# Altium schematic sheet 3.3v_BUCK.SchDoc: Shipwars Buck Schematic
size 431 x 279 mm; CheckedBy: SP, PS; Author: SP, PS; CompanyName: UPenn; DrawnBy: SP, PS; Engineer: SP, PS; Organization: UPenn; Address1: 200 S 33rd Street; Address2: Detkin Lab; Address3: Philadelphia; Address4: PA 19104; Revision: .1.0.0; SheetNumber: 7; SheetTotal: 10; Project: Shipwars
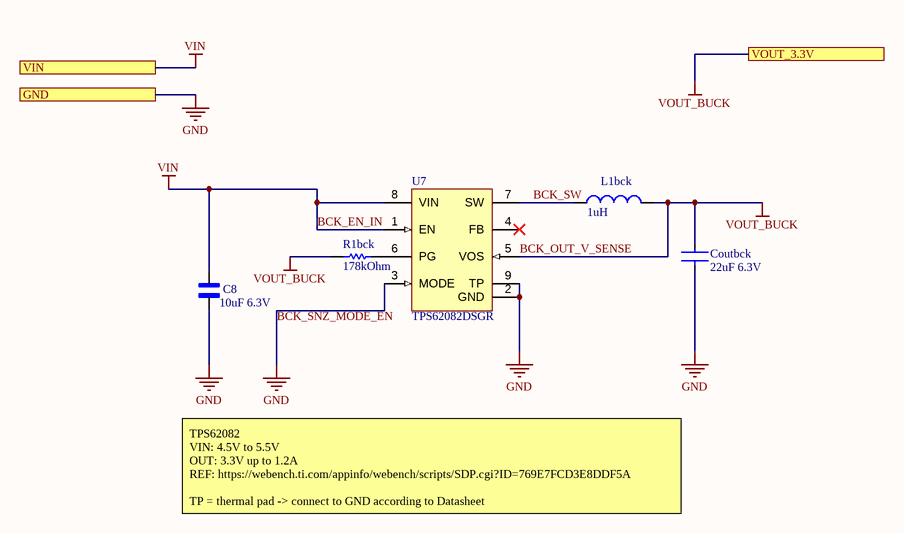
[diagram p0: 3.3v_BUCK.SchDoc]

## Parts
C8  10uF 6.3V  [GRJ155R60J106ME11D]
Coutbck  22uF 6.3V  [FP-GRM188-0_2-IPC_B]
L1bck  1uH  [WE-HCI-7040]
R1bck  178kOhm  [RESC1608X55X25NL10T15]
U7  TPS62082DSGR  [DSG8-1600X900TP]

## Ports
GND, VIN, VOUT_3.3V

## Nets
BCK_EN_IN: C8.2 U7.1(EN) U7.8(VIN) ; port VIN  [also labelled VIN]
BCK_OUT_V_SENSE: Coutbck.2 L1bck.2 R1bck.1 U7.5(VOS) ; port VOUT_3.3V  [also labelled VOUT_BUCK]
BCK_SNZ_MODE_EN: C8.1 Coutbck.1 U7.2(GND) U7.3(MODE) U7.9(TP) ; port GND  [also labelled GND]
BCK_SW: L1bck.1 U7.7(SW)
NetR1bck_2: R1bck.2 U7.6(PG)

Not connected (* = marked no-connect by the designer): U7 4(FB)*

## Notes on the sheet
- TPS62082
  VIN: 4.5V to 5.5V
  OUT: 3.3V up to 1.2A
  REF: https://webench.ti.com/appinfo/webench/scripts/SDP.cgi?ID=769E7FCD3E8DDF5A
  TP = thermal pad -> connect to GND according to Datasheet
- DWG. NO.
- REV.
- SHT.
- THIS DOCUMENT AND THE DATA DISCLOSED HEREIN OR HEREWITH IS THE PROPERTY OF ALTIUM LIMITED AND MAY BE FREELY DISTRIBUTED IN WHOLE. NO RIGHTS ARE RESERVED OR EXPRESS OR IMPLIED WARANTEE GIVEN.
- REVISION
- DESCRIPTION
- DATE
- APPROVED
- ENG:
- APPROVALS
- PROJECT
- DSN:
- CHK:
- REFERENCE DOCUMENTS
- PROJECT REVISION:
- TITLE
- DOCUMENT REVISION:
- DESIGN ITEM:
- BOM:
- FAB DWG:
- PCB DWG:
- ASSY DWG:
- SCALE:
- SIZE
- B
- CAGE CODE
- FILE NAME
- DWG NO.
- SHEET
- OF
- REV

## Library data of the parts
C8 = GRJ155R60J106ME11D: Capacitor Ceramic Mlcc 0402 10UF 6.3V SMD; Manufacturer: Murata; Tolerance: 20%; Supplier 1: Digi-Key; Manufacturer Part Number: GRJ155R60J106ME11D; RoHS: Yes; Category: Ceramic Capacitors; Stock 1: 1880133; Pricing 1: 10000=0.03490, 20000=0.03307 (USD); Mount: Surface Mount; Case/Package: 0402; Case Code (Metric): 1005; Case Code (Imperial): 0402; Min Operating Temperature: -55°C; Max Operating Temperature: 85°C; Packaging: Cut Tape; Capacitance: 10uF; Voltage Rating: 6.3V; Features: Soft Termination; Length: 0.039inch; Width: 0.02inch; Thickness: 0.028inch; RoHS Compliant: Yes; ComponentLink1URL: http://psearch.en.murata.com/capacitor/product/GRJ155R60J106ME11%23.pdf?src-supplier=Digi-Key; ComponentLink1Description: http://psearch.en.murata.com/capacitor/product/GRJ155R60J106ME11%23.pdf?src-supplier=Digi-Key
Coutbck = CMP-2006-02797-2: Chip Multilayer Ceramic Capacitors for General Purpose, 0603, 22uF, X5R, 15%, 20%, 6.3V GRM188R60J226MEA0D; Package Quantity: 4000; Case/Package: 0603; Dielectric: X5R; Packaging: Tape and Reel; Mount: Surface Mount; Voltage Rating: 6.3V; Lead Free: Lead Free; Voltage Rating (DC): 6.3V; Depth: 0.8mm; Case Code (Metric): 1608; Case Code (Imperial): 0603; Weight: 0.000222oz; REACH SVHC: No SVHC; Max Operating Temperature: 85°C; Tolerance: 20%; Min Operating Temperature: -55°C; Thickness: 0.039inch; Capacitance: 22uF; Length: 1.6mm; Height: 0.8mm; Termination: SMD/SMT; Width: 0.8mm
L1bck = CMP-0226-00067-1: SMD Flat Wire High Current Inductor WE-HCI, L=1.00 µH 744311100; Inductance: 1.00 ÂµH; PackageReference: WE-HCI-7040; ComponentLink2Description: Datasheet; ComponentLink1Description: Manufacturer Link; PackageVersion: 2008; ComponentLink2URL: http://www.we-online.de/katalog/media/pdf/744311100.pdf; DatasheetVersion: ver 1, Feb-2008; PackageDescription: SMD Inductor, 2-Leads, Body 7.0 x 6.9 mm; ComponentLink1URL: http://www.we-online.com
R1bck = CMP-1012-00762-2: RC0603FR-07178KL; Manufacturer: Yageo; Part Number: RC0603FR-07178KL
U7 = CMP-0323-00344-1: Buck Step Down Regulator with 2.3 to 6 V Input and 3.3 V Output, -40 to 85 degC, 8-Pin WSON (DSG), Green (RoHS & no Sb/Br); Manufacturer: Texas Instruments; Vout(Min)(V): 3.3; Switch Current Limit(Typ)(A): 2.4; SubFamily: Step-Down Regulator; Iout(Max)(A): 1.2; Vin(Min)(V): 2.3; Regulated Outputs(#): 1; Iq(Typ)(mA): 0.006; Rating: Catalog; Duty Cycle(Max)(%): 100; Vin(Max)(V): 6; DatasheetVersion: SLVSAE8B; PackageDescription: 8-Pin Plastic Small Outline No-Lead, 2 x 2 x 0.8 mm Body, 0.5 mm Pitch, Exposed Pad; Eco-Plan: Green (RoHS & no Sb/Br); ComponentLink1URL: http://www.ti.com/general/docs/lit/getliterature.tsp?genericPartNumber=TPS62082&fileType=pdf; ComponentLink2URL: Samples URL:http://www.ti.com/product/tps62082#samples; Topology: Buck; PartNumber: TPS62082DSGR; ComponentLink2Description: URL Link1; Vout(Max)(V): 3.3; Code_JEDEC: MO-229; PackageReference: DSG8-1600X900TP; ComponentLink1Description: Datasheet; Mounting Technology: Surface Mount; PackageVersion: revB, Oct-2010